# EAGLE design power_extension (EAGLE 7.6.0)
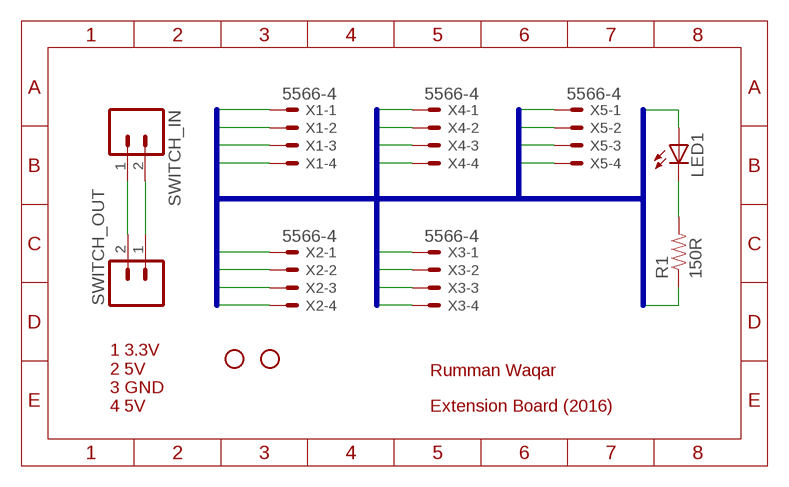
[diagram p0: schematic, sheet 1]

## Parts
JP1  STAND-OFF  [STAND-OFF]
JP2  STAND-OFF  [STAND-OFF]
LED1  LED-FKIT-1206  [FKIT-LED-1206]
R1  150R  RESISTOR0805-RES  [0805]
SWITCH_IN  M02POLAR  [MOLEX-1X2]
SWITCH_OUT  M02POLAR  [MOLEX-1X2]
X1  5566-4  [5566-4]
X2  5566-4  [5566-4]
X3  5566-4  [5566-4]
X4  5566-4  [5566-4]
X5  5566-4  [5566-4]

## Nets
N$1: SWITCH_IN.1 SWITCH_OUT.2
N$2: SWITCH_IN.2 SWITCH_OUT.1
N$3: LED1.C R1.2
P1: X1.1 X2.1 X3.1 X4.1 X5.1
P2: X1.2 X2.2 X3.2 X4.2 X5.2
P3: R1.1 X1.3 X2.3 X3.3 X4.3 X5.3
P4: LED1.A X1.4 X2.4 X3.4 X4.4 X5.4

## Buses
P[1..4]

## Notes on the sheet
- Rumman Waqar
- 1 3.3V
  2 5V
  3 GND
  4 5V
- Extension Board (2016)

## Library data of the parts
JP1 JP2 = SparkFun:STAND-OFF: Stand Off This is the mechanical footprint for a #4 phillips button head screw. Use the keepout ring to avoid running the screw head into surrounding components. SKU : PRT-00447
LED1 = SparkFun:LED: LEDs Standard schematic elements and footprints for 5mm, 3mm, 1206, and 0603 sized LEDs. 5mm - Spark Fun Electronics SKU : COM-00529 (and others)
R1 = SparkFun:RESISTOR: Resistor Basic schematic elements and footprints for 0603, 1206, and PTH resistors.
SWITCH_IN SWITCH_OUT = SparkFun:M02: Header 2 Standard 2-pin 0.1" header. Use with straight break away headers (SKU : PRT-00116), right angle break away headers (PRT-00553), swiss pins (PRT-00743), machine pins (PRT-00117), and female headers (PRT-00115). Molex polarized connector foot print use with SKU : PRT-08233 with associated crimp pins and housings.
X1-X5 = con-molex:5566-4: Mini FIT connector 4 pol Source: http://www.molex.com; OC_FARNELL: unknown; OC_NEWARK: unknown

## Board
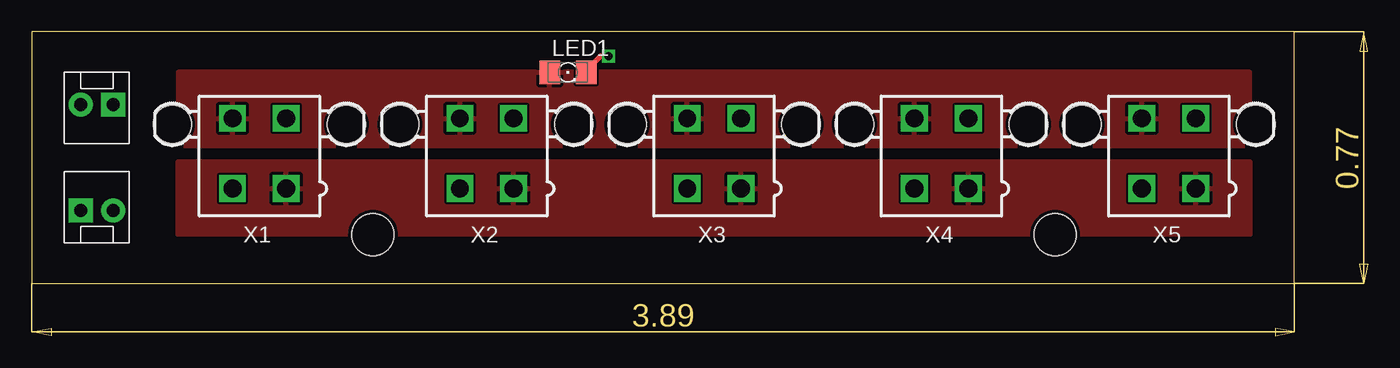
[diagram p1: board, top side]
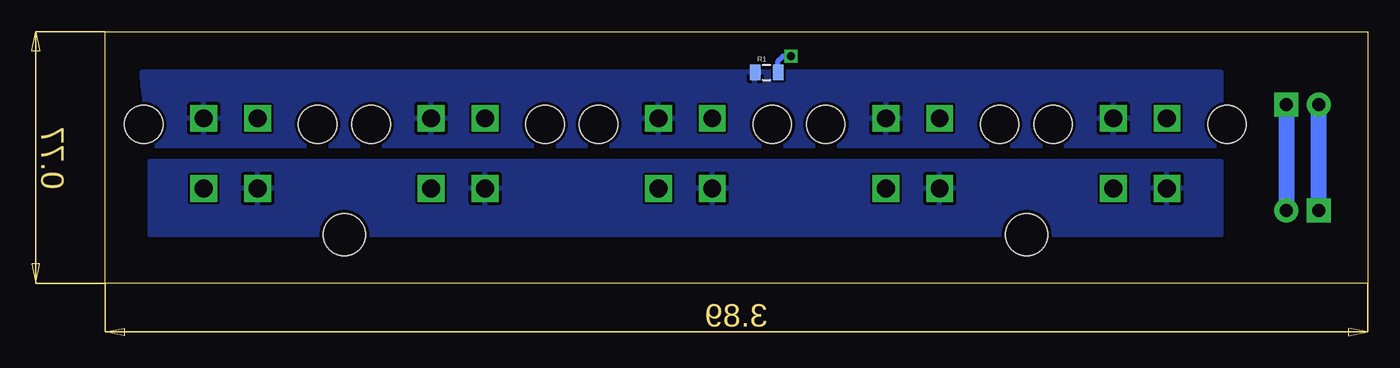
[diagram p2: board, bottom side, seen from below]

Size 98.73 x 19.68 mm. Coordinates in mm from the lower left corner, seen from the top.
Outline: 0,0 98.73,0 98.73,19.68 0,19.68 0,0
Copper layers (1*16): Top 0.035mm / dielectric 1.5mm / Bottom 0.035mm
Design rules "apcircuits": minimum track width 0.18mm, minimum drill 20mil, track to track 0.18mm, track to pad 0.18mm, pad to pad 0.18mm, via to via 0.18mm, smd to smd 0.18mm, copper to edge 0.25mm, drill to drill 0.25mm, minimum pad ring 10mil, minimum via ring 8mil, stop-mask expansion 4mil, vias tented up to drill 0mil, thermal gap 10mil

### Footprints (pad centres in the part's own frame; a part is rotated, then mirrored left to right if it is on the bottom)
STAND-OFF = hole 3.302: 0,0
FKIT-LED-1206 = smd 1.6 x 1.803: A -1.422,0; C 1.422,0
0805 = smd 0.8 x 1.2: 1 -0.9,0; 2 0.9,0
MOLEX-1X2 = drill 1.016 pad 1.88 square: 1 0,0 | drill 1.016 pad 1.88: 2 2.54,0
5566-4 = drill 1.4 square: 1 2.1,-2.75; 2 -2.1,-2.75; 3 2.1,2.75; 4 -2.1,2.75 | hole 3: 6.8,2.29; -6.8,2.29

### Placement (x,y rotation side)
JP1  26.67,3.81 0 top
JP2  80.01,3.81 0 top
LED1  41.91,16.51 0 top
R1  46.99,16.51 0 bottom
SWITCH_IN  6.35,13.97 180 top
SWITCH_OUT  3.81,5.71 0 top
X1  17.78,10.16 0 top
X2  35.56,10.16 0 top
X3  53.34,10.16 0 top
X4  71.12,10.16 0 top
X5  88.9,10.16 0 top

### Tracks (layer width: path | path; a pad name or v marks a point on that pad's centre or on a via)
N$1
  Bottom 1.27: SWITCH_IN.1 SWITCH_OUT.2
N$2
  Bottom 1.27: SWITCH_OUT.1 SWITCH_IN.2
N$3  (via drill 0.6)
  Top 0.406: LED1.C 43.33,16.66 44.45,17.78 v45.09,17.78
  Bottom 0.406: R1.2 46.09,17.41 45.72,17.78 v45.09,17.78
P1
  pour Top: 11.43,9.53 95.25,9.53 95.25,3.81 11.43,3.81
P2
  pour Bottom: 11.43,9.53 95.25,9.53 95.25,3.81 11.43,3.81
P3
  pour Bottom: 11.43,16.51 95.89,16.51 95.25,10.79 11.43,10.79
P4
  pour Top: 11.43,10.79 95.25,10.79 95.25,16.51 11.43,16.51